# Altium schematic sheet Atmega328P.SchDoc
size A4; SheetNumber: 2; SheetTotal: 8
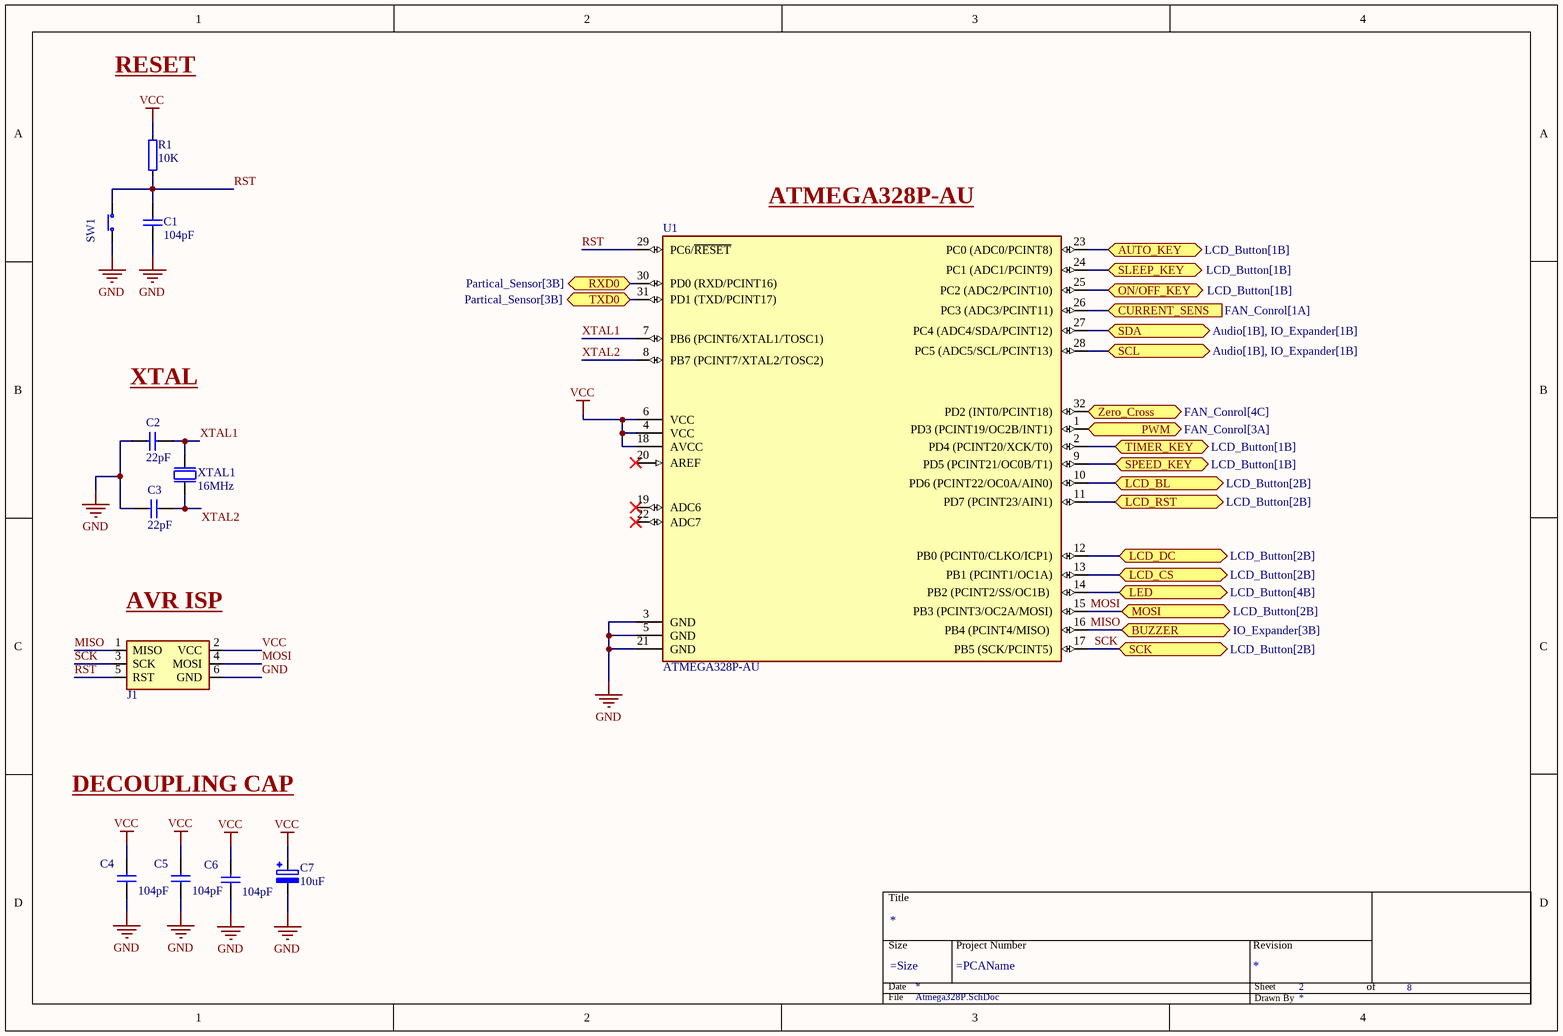
[diagram p0: Atmega328P.SchDoc]

## Parts
*  Title Block  (value not drawn)  (graphical)
C1  104pF  [CAPC2012X140N]
C2  22pF  [CAPC2012X140N]
C3  22pF  [CAPC2012X140N]
C4  104pF  [CAPC2012X140N]
C5  104pF  [CAPC2012X140N]
C6  104pF  [CAPC2012X140N]
C7  10uF  [CAPPRD250W50D630H1250]
J1  AVRISP Header  [AVRISP_Header]  (value not drawn)
R1  10K  [RESC2012X65N]
SW1  (no value)  [SW_TL1105F160Q]
U1  ATMEGA328P-AU  [QFP80P900X900X120-32N]
XTAL1  16MHz  [XTAL_ECS-160-20-16X]

## Ports
AUTO_KEY (bidir, see LCD_Button[1B]), BUZZER (bidir, see IO_Expander[3B]), CURRENT_SENS (in, see FAN_Conrol[1A]), LCD_BL (bidir, see LCD_Button[2B]), LCD_CS (bidir, see LCD_Button[2B]), LCD_DC (bidir, see LCD_Button[2B]), LCD_RST (bidir, see LCD_Button[2B]), LED (bidir, see LCD_Button[4B]), MOSI (bidir, see LCD_Button[2B]), ON/OFF_KEY (bidir, see LCD_Button[1B]), PWM (bidir, see FAN_Conrol[3A]), RXD0 (bidir, see Partical_Sensor[3B]), SCK (bidir, see LCD_Button[2B]), SCL (bidir, see Audio[1B], IO_Expander[1B]), SDA (bidir, see Audio[1B], IO_Expander[1B]), SLEEP_KEY (bidir, see LCD_Button[1B]), SPEED_KEY (bidir, see LCD_Button[1B]), TIMER_KEY (bidir, see LCD_Button[1B]), TXD0 (bidir, see Partical_Sensor[3B]), Zero_Cross (bidir, see FAN_Conrol[4C])

## Nets
GND: C1.1 C2.1 C3.1 C4.1 C5.1 C6.1 C7.2 J1.6(GND) SW1.2(COM) U1.3(GND) U1.5(GND) U1.21(GND)
VCC: C4.2 C5.2 C6.2 C7.1 J1.2(VCC) R1.2 U1.4(VCC) U1.6(VCC) U1.18(AVCC)
AUTO_KEY: U1.23(PC0_(ADC0/PCINT8)) ; port AUTO_KEY
CURRENT_SENS: U1.26(PC3_(ADC3/PCINT11)) ; port CURRENT_SENS
LCD_BL: U1.10(PD6_(PCINT22/OC0A/AIN0)) ; port LCD_BL
LCD_CS: U1.13(PB1_(PCINT1/OC1A)) ; port LCD_CS
LCD_DC: U1.12(PB0_(PCINT0/CLKO/ICP1)) ; port LCD_DC
LCD_RST: U1.11(PD7_(PCINT23/AIN1)) ; port LCD_RST
LED: U1.14(PB2_(PCINT2/SS/OC1B)) ; port LED
MISO: J1.1(MISO) U1.16(PB4_(PCINT4/MISO)) ; port BUZZER
MOSI: J1.4(MOSI) U1.15(PB3_(PCINT3/OC2A/MOSI)) ; port MOSI
ON/OFF_KEY: U1.25(PC2_(ADC2/PCINT10)) ; port ON/OFF_KEY
PWM: U1.1(PD3_(PCINT19/OC2B/INT1)) ; port PWM
RST: C1.2 J1.5(RST) R1.1 SW1.1(N.O) U1.29(PC6/~{RESET})
RXD0: U1.30(PD0_(RXD/PCINT16)) ; port RXD0
SCK: J1.3(SCK) U1.17(PB5_(SCK/PCINT5)) ; port SCK
SCL: U1.28(PC5_(ADC5/SCL/PCINT13)) ; port SCL
SDA: U1.27(PC4_(ADC4/SDA/PCINT12)) ; port SDA
SLEEP_KEY: U1.24(PC1_(ADC1/PCINT9)) ; port SLEEP_KEY
SPEED_KEY: U1.9(PD5_(PCINT21/OC0B/T1)) ; port SPEED_KEY
TIMER_KEY: U1.2(PD4_(PCINT20/XCK/T0)) ; port TIMER_KEY
TXD0: U1.31(PD1_(TXD/PCINT17)) ; port TXD0
XTAL1: C2.2 U1.7(PB6_(PCINT6/XTAL1/TOSC1)) XTAL1.2(out)
XTAL2: C3.2 U1.8(PB7_(PCINT7/XTAL2/TOSC2)) XTAL1.1(inp)
Zero_Cross: U1.32(PD2_(INT0/PCINT18)) ; port Zero_Cross

Not connected (* = marked no-connect by the designer): U1 19(ADC6)* 20(AREF)* 22(ADC7)*

## Notes on the sheet
- RESET
- (near U1) ATMEGA328P-AU
- XTAL
- (near J1) AVR ISP
- DECOUPLING CAP
- (in symbol Title Block) Title; Size; Project Number; Revision; Date; Sheet; of; File; Drawn By

## Library data of the parts
C1-C6 = CAP_0805: Part Number: CAP_0805; Pin Count: 2; Publisher: Metal Circuits
  C1 C4-C6: Value: 104pF
  C2 C3: Value: 22pF
C7 = Electrolytic Capacitor 6.3mm: Ø6.3 x 11mm LS=2.5mm Radial Aluminum Electrolytic Cap; Part Number: Cap Electrolytic; Manufacturer Part Number: Cap Electrolytic; Pin Count: 2; Publisher: Metal Circuits; Value: 10uF; FootPrint Doc: Radial
J1 = 67997-206HLF: AVR ISP Programming 2x3 Header male 2.54mm pith; Manufacturer: Amphenol ICC (FCI); Part Number: 67997-206HLF; Manufacturer Part Number: 67997-206HLF; Pin Count: 6; Publisher: Metal Circuits; Value: AVRISP Header
R1 = RES_0805: RES SMD 1% 1/10W 0805; Part Number: RES_0805; Pin Count: 2; Publisher: Metal Circuits; Value: 10K; FootPrint Doc: 0805
SW1 = SW-PB: Tactile Switch, SPNO, Through Hole; Part Number: SW-PB; Manufacturer Part Number: SW-PB; Pin Count: 4; Publisher: Metal Circuits
U1 = ATMEGA328P-AU: AVR AVR® ATmega Microcontroller IC 8-Bit 20MHz 32KB (16K x 16) FLASH 32-TQFP (7x7); Manufacturer: Microchip Technology; Part Number: ATMEGA328P-AU; Manufacturer Part Number: ATMEGA328P-AU; Pin Count: 32; Publisher: Metal Circuits; Value: ATMEGA328P-AU; FootPrint Doc: 32-TQFP; HelpURL: https://ww1.microchip.com/downloads/en/DeviceDoc/ATmega48A-PA-88A-PA-168A-PA-328-P-DS-DS40002061B.pdf; Supplier 1: Digi-Key; Supplier Part Number 1: ATMEGA328P-AU-ND
XTAL1 = ECS-40-20-4: 16 MHz ±30ppm Crystal 20pF 150 Ohms HC-49/US; Manufacturer: ECS Inc.; Part Number: ECS-40-20-4; Manufacturer Part Number: ECS-40-20-4; Pin Count: 2; Publisher: Metal Circuits; Value: 16MHz; FootPrint Doc: XTAL_ECS-160-20-16X